# EAGLE schematic Prototyping-Board (EAGLE 5.11)
DRAWN_BY: Alexios; PROJECT_NAME: CFT Mini-Computer; REVISION: Rev K; SHEET_DESCRIPTION: Bus Connectors; SIMULATION_FILENAME: N/A; URL: http://www.bedroomlan.org/cft

## Sheet 1 of 3
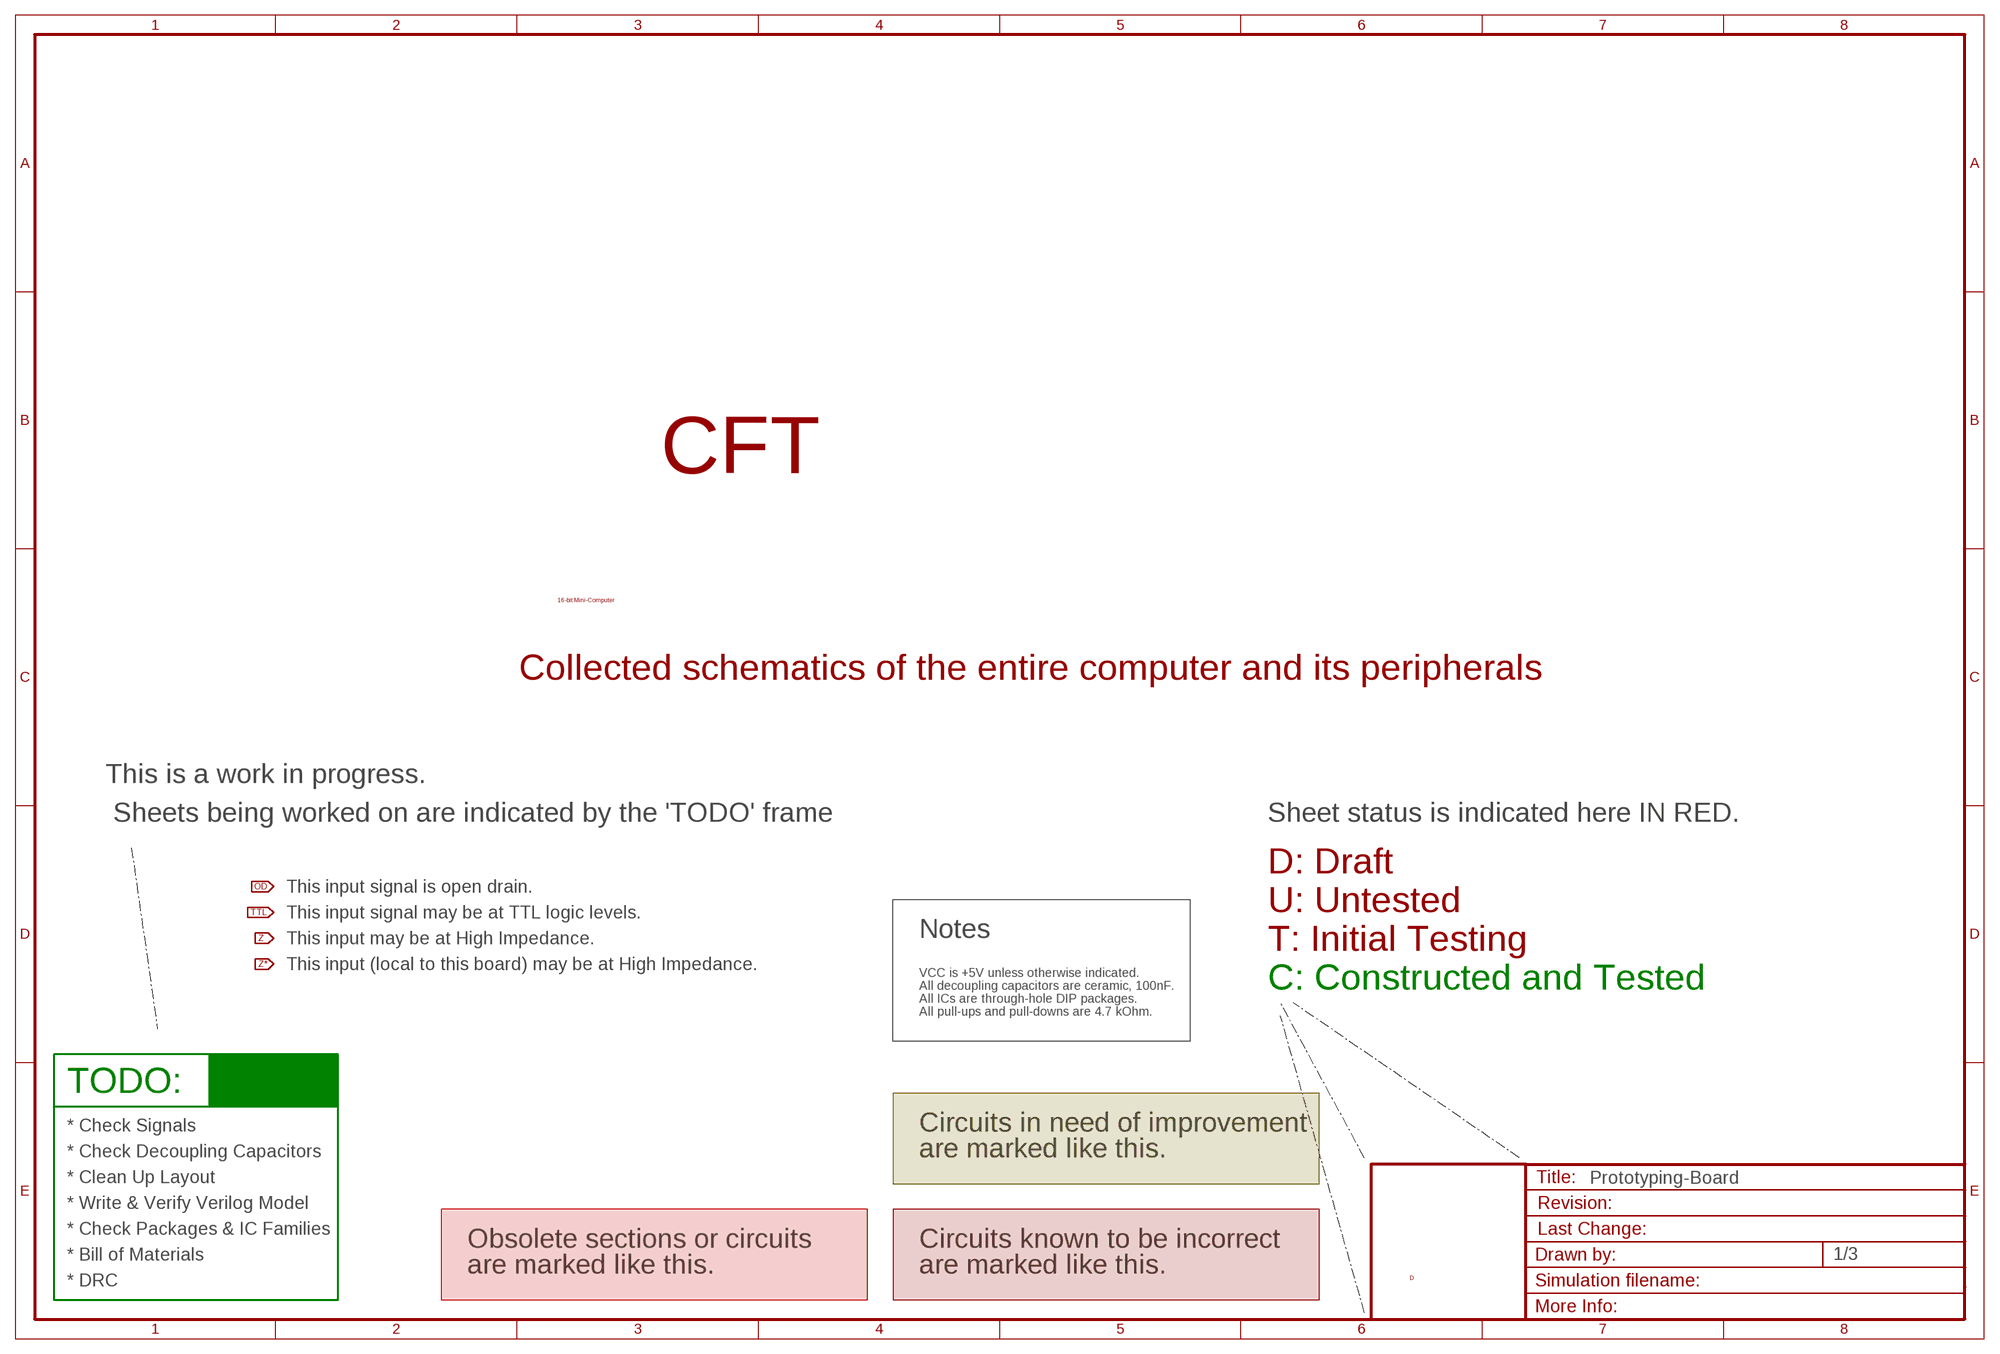
[diagram p0: schematic, sheet 1]

### Notes on the sheet
- CFT
- 16-bit Mini-Computer
- Collected schematics of the entire computer and its peripherals
- This is a work in progress.
- Sheets being worked on are indicated by the 'TODO' frame | Sheet status is indicated here IN RED.
- D: Draft
- This input signal is open drain.
- U: Untested
- This input signal may be at TTL logic levels.
- Notes
- This input may be at High Impedance.
- T: Initial Testing
- This input (local to this board) may be at High Impedance.
- VCC is +5V unless otherwise indicated.
- All decoupling capacitors are ceramic, 100nF. | C: Constructed and Tested
- All ICs are through-hole DIP packages.
- All pull-ups and pull-downs are 4.7 kOhm.
- TODO:
- * Check Signals | Circuits in need of improvement
- * Check Decoupling Capacitors | are marked like this.
- * Clean Up Layout
- * Write & Verify Verilog Model
- * Check Packages & IC Families
- Obsolete sections or circuits | Circuits known to be incorrect
- * Bill of Materials
- are marked like this. | are marked like this.
- D
- * DRC

## Sheet 2 of 3
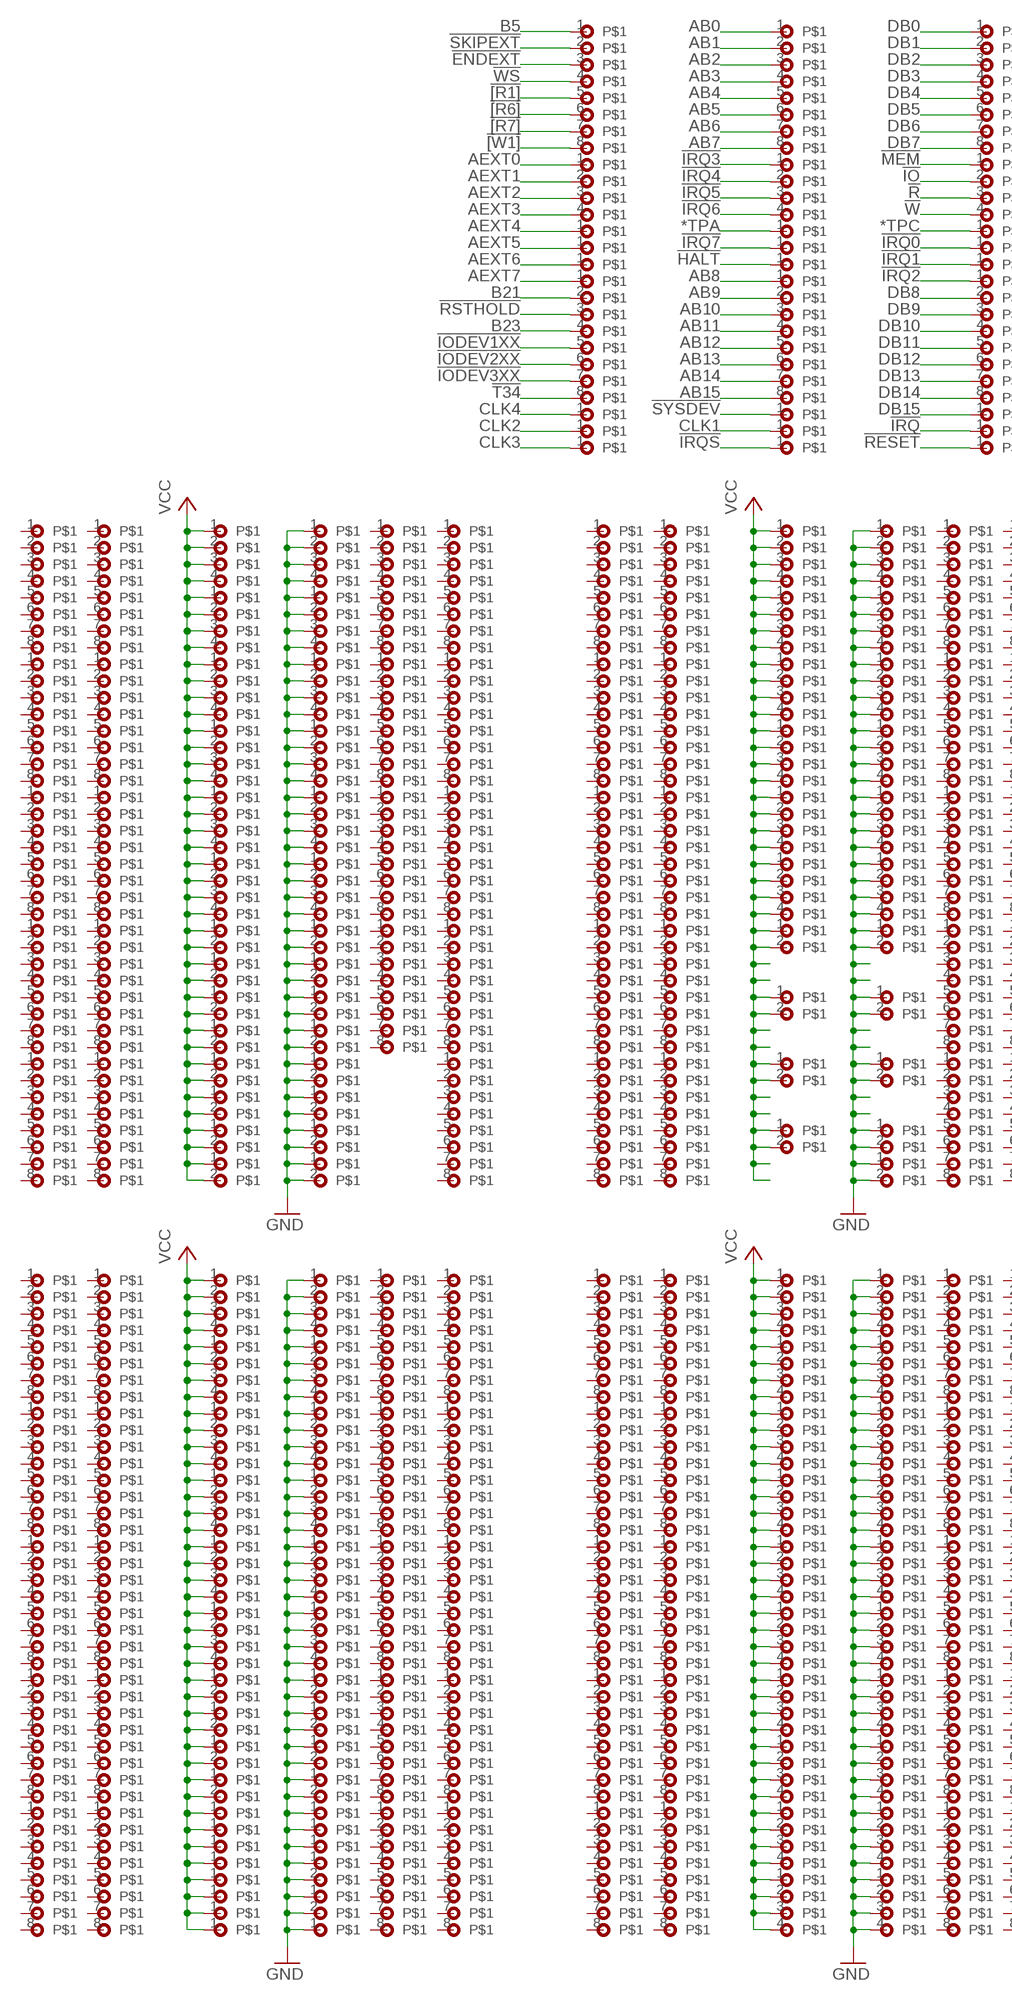
[diagram p1: schematic, sheet 2, part 1 of 3]
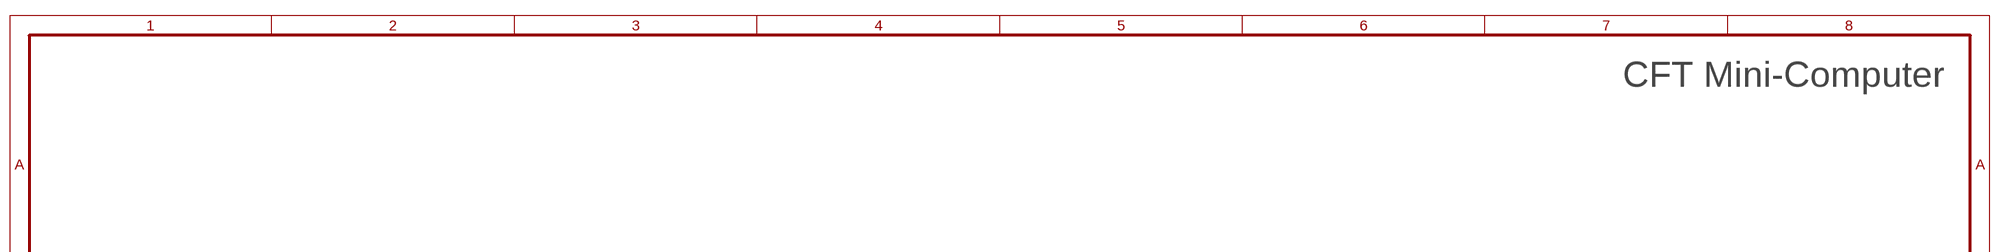
[diagram p2: schematic, sheet 2, part 2 of 3]
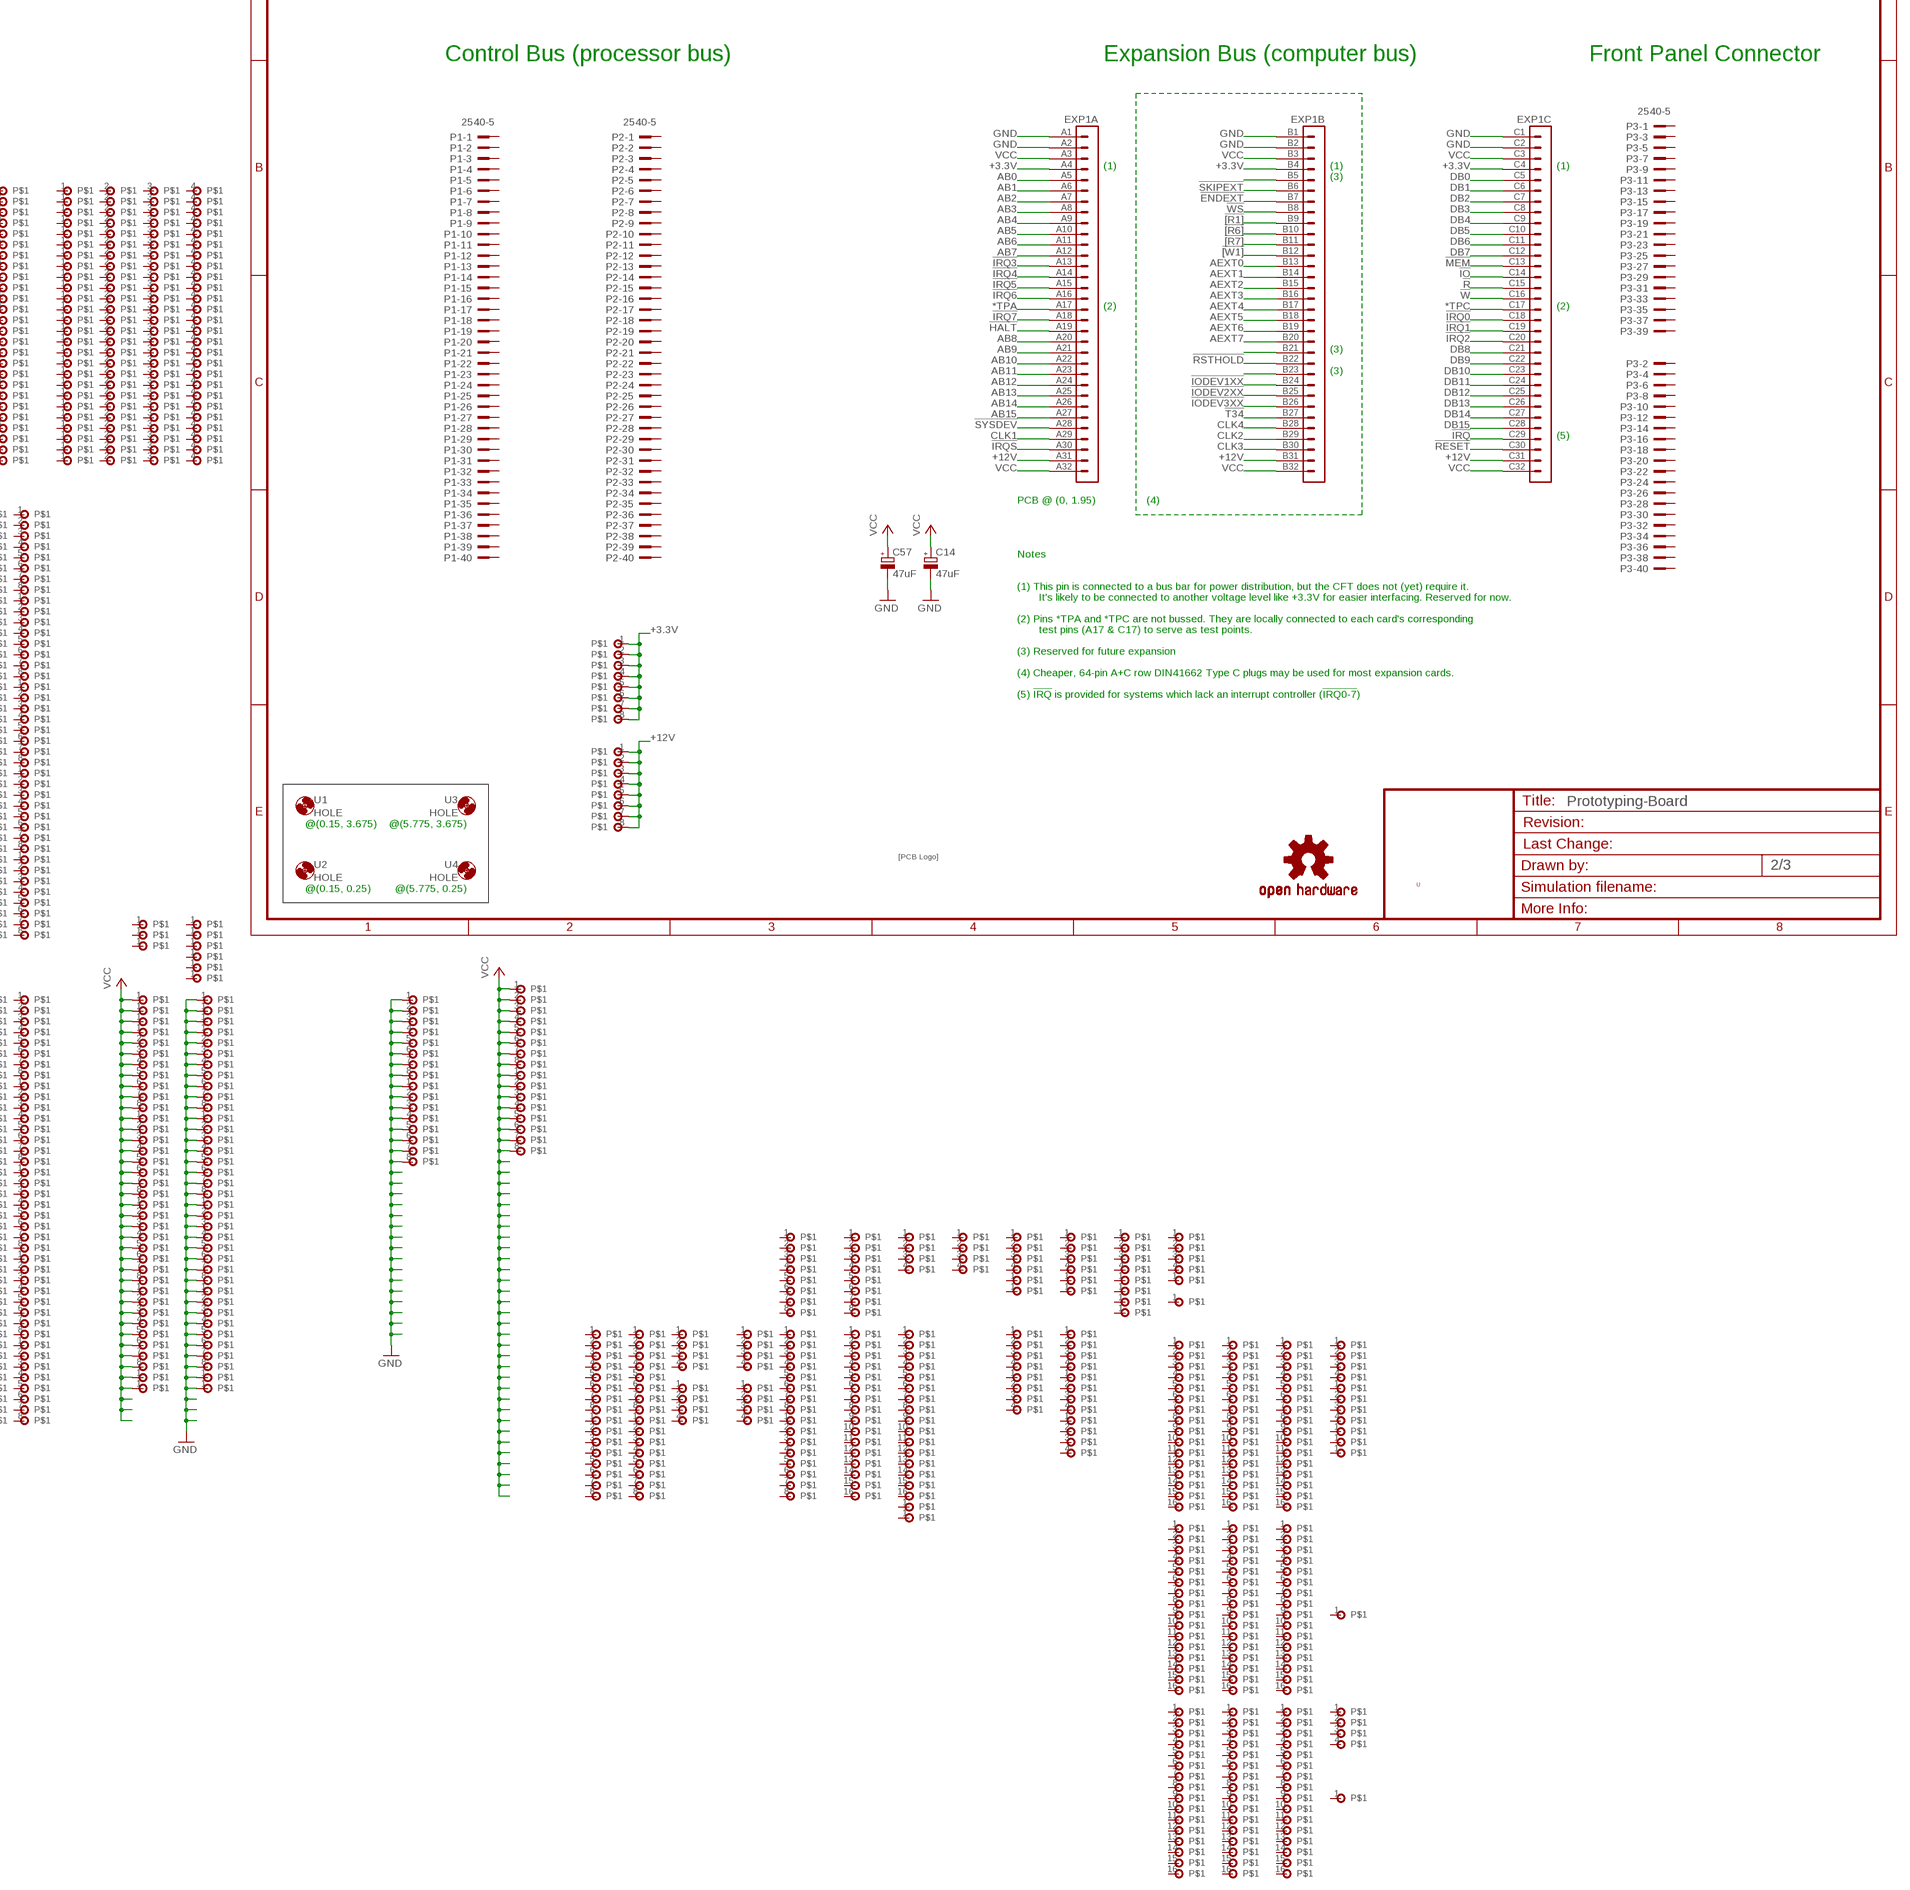
[diagram p3: schematic, sheet 2, part 3 of 3]

### Parts
$4_37_$1  SIGNATURESILK  [SIGNATURE]
$4_39_$1  OSHW-LOGOL  [OSHW-LOGO-L]
C14  47uF  CPOL-EUE2.5-5  [E2,5-5]
C57  47uF  CPOL-EUE2.5-5  [E2,5-5]
EXP1  VG96-3K  [VG96K]
P1  2540-5  [PAK100/2500-5-40]
P2  2540-5  [PAK100/2500-5-40]
P3  2540-5  [PAK100/2500-5-40]
P4  PROTOTYPING-PAD-1X8  [PAD-8X1]
P5  PROTOTYPING-PAD-1X8  [PAD-8X1]
P6  PROTOTYPING-PAD-1X4  [PAD-4X1]
P7  PROTOTYPING-PAD-1X1  [PAD-1X1]
P8  PROTOTYPING-PAD-1X1  [PAD-1X1]
P9  PROTOTYPING-PAD-1X1  [PAD-1X1]
P10  PROTOTYPING-PAD-1X1  [PAD-1X1]
P11  PROTOTYPING-PAD-1X1  [PAD-1X1]
P12  PROTOTYPING-PAD-1X1  [PAD-1X1]
P13  PROTOTYPING-PAD-1X8  [PAD-8X1]
P14  PROTOTYPING-PAD-1X8  [PAD-8X1]
P15  PROTOTYPING-PAD-1X8  [PAD-8X1]
P16  PROTOTYPING-PAD-1X8  [PAD-8X1]
P17  PROTOTYPING-PAD-1X4  [PAD-4X1]
P18  PROTOTYPING-PAD-1X1  [PAD-1X1]
P19  PROTOTYPING-PAD-1X1  [PAD-1X1]
P20  PROTOTYPING-PAD-1X1  [PAD-1X1]
P21  PROTOTYPING-PAD-1X1  [PAD-1X1]
P22  PROTOTYPING-PAD-1X1  [PAD-1X1]
P23  PROTOTYPING-PAD-1X1  [PAD-1X1]
P24  PROTOTYPING-PAD-1X8  [PAD-8X1]
P25  PROTOTYPING-PAD-1X8  [PAD-8X1]
P26  PROTOTYPING-PAD-1X4  [PAD-4X1]
P27  PROTOTYPING-PAD-1X1  [PAD-1X1]
P28  PROTOTYPING-PAD-1X1  [PAD-1X1]
P29  PROTOTYPING-PAD-1X1  [PAD-1X1]
P30  PROTOTYPING-PAD-1X1  [PAD-1X1]
P31  PROTOTYPING-PAD-1X1  [PAD-1X1]
P32  PROTOTYPING-PAD-1X1  [PAD-1X1]
P33  PROTOTYPING-PAD-1X4  [PAD-4X1]
P34  PROTOTYPING-PAD-1X4  [PAD-4X1]
P35  PROTOTYPING-PAD-1X4  [PAD-4X1]
P36  PROTOTYPING-PAD-1X4  [PAD-4X1]
P37  PROTOTYPING-PAD-1X4  [PAD-4X1]
P38  PROTOTYPING-PAD-1X4  [PAD-4X1]
P39  PROTOTYPING-PAD-1X4  [PAD-4X1]
P40  PROTOTYPING-PAD-1X4  [PAD-4X1]
P41  PROTOTYPING-PAD-1X4  [PAD-4X1]
P42  PROTOTYPING-PAD-1X4  [PAD-4X1]
P43  PROTOTYPING-PAD-1X8  [PAD-8X1]
P44  PROTOTYPING-PAD-1X8  [PAD-8X1]
P45  PROTOTYPING-PAD-1X8  [PAD-8X1]
P46  PROTOTYPING-PAD-1X8  [PAD-8X1]
P47  PROTOTYPING-PAD-1X8  [PAD-8X1]
P48  PROTOTYPING-PAD-1X8  [PAD-8X1]
P49  PROTOTYPING-PAD-1X8  [PAD-8X1]
P50  PROTOTYPING-PAD-1X8  [PAD-8X1]
P51  PROTOTYPING-PAD-1X8  [PAD-8X1]
P52  PROTOTYPING-PAD-1X8  [PAD-8X1]
P53  PROTOTYPING-PAD-1X8  [PAD-8X1]
P54  PROTOTYPING-PAD-1X8  [PAD-8X1]
P55  PROTOTYPING-PAD-1X8  [PAD-8X1]
P56  PROTOTYPING-PAD-1X8  [PAD-8X1]
P57  PROTOTYPING-PAD-1X8  [PAD-8X1]
P58  PROTOTYPING-PAD-1X8  [PAD-8X1]
P59  PROTOTYPING-PAD-1X8  [PAD-8X1]
P60  PROTOTYPING-PAD-1X8  [PAD-8X1]
P61  PROTOTYPING-PAD-1X8  [PAD-8X1]
P62  PROTOTYPING-PAD-1X8  [PAD-8X1]
P63  PROTOTYPING-PAD-1X4  [PAD-4X1]
P64  PROTOTYPING-PAD-1X4  [PAD-4X1]
P65  PROTOTYPING-PAD-1X4  [PAD-4X1]
P66  PROTOTYPING-PAD-1X4  [PAD-4X1]
P67  PROTOTYPING-PAD-1X4  [PAD-4X1]
P68  PROTOTYPING-PAD-1X4  [PAD-4X1]
P69  PROTOTYPING-PAD-1X4  [PAD-4X1]
P70  PROTOTYPING-PAD-1X4  [PAD-4X1]
P71  PROTOTYPING-PAD-1X4  [PAD-4X1]
P72  PROTOTYPING-PAD-1X4  [PAD-4X1]
P73  PROTOTYPING-PAD-1X8  [PAD-8X1]
P74  PROTOTYPING-PAD-1X8  [PAD-8X1]
P75  PROTOTYPING-PAD-1X8  [PAD-8X1]
P76  PROTOTYPING-PAD-1X8  [PAD-8X1]
P77  PROTOTYPING-PAD-1X4  [PAD-4X1]
P78  PROTOTYPING-PAD-1X8  [PAD-8X1]
P79  PROTOTYPING-PAD-1X8  [PAD-8X1]
P80  PROTOTYPING-PAD-1X8  [PAD-8X1]
P81  PROTOTYPING-PAD-1X8  [PAD-8X1]
P82  PROTOTYPING-PAD-1X8  [PAD-8X1]
P83  PROTOTYPING-PAD-1X8  [PAD-8X1]
P84  PROTOTYPING-PAD-1X8  [PAD-8X1]
P85  PROTOTYPING-PAD-1X8  [PAD-8X1]
P86  PROTOTYPING-PAD-1X8  [PAD-8X1]
P87  PROTOTYPING-PAD-1X8  [PAD-8X1]
P88  PROTOTYPING-PAD-1X8  [PAD-8X1]
P89  PROTOTYPING-PAD-1X8  [PAD-8X1]
P90  PROTOTYPING-PAD-1X8  [PAD-8X1]
P91  PROTOTYPING-PAD-1X8  [PAD-8X1]
P92  PROTOTYPING-PAD-1X8  [PAD-8X1]
P93  PROTOTYPING-PAD-1X4  [PAD-4X1]
P94  PROTOTYPING-PAD-1X4  [PAD-4X1]
P95  PROTOTYPING-PAD-1X4  [PAD-4X1]
P96  PROTOTYPING-PAD-1X4  [PAD-4X1]
P97  PROTOTYPING-PAD-1X4  [PAD-4X1]
P98  PROTOTYPING-PAD-1X4  [PAD-4X1]
P99  PROTOTYPING-PAD-1X4  [PAD-4X1]
P100  PROTOTYPING-PAD-1X4  [PAD-4X1]
P101  PROTOTYPING-PAD-1X4  [PAD-4X1]
P102  PROTOTYPING-PAD-1X4  [PAD-4X1]
P103  PROTOTYPING-PAD-1X8  [PAD-8X1]
P104  PROTOTYPING-PAD-1X8  [PAD-8X1]
P105  PROTOTYPING-PAD-1X8  [PAD-8X1]
P106  PROTOTYPING-PAD-1X8  [PAD-8X1]
P107  PROTOTYPING-PAD-1X8  [PAD-8X1]
P108  PROTOTYPING-PAD-1X8  [PAD-8X1]
P109  PROTOTYPING-PAD-1X8  [PAD-8X1]
P110  PROTOTYPING-PAD-1X8  [PAD-8X1]
P111  PROTOTYPING-PAD-1X8  [PAD-8X1]
P112  PROTOTYPING-PAD-1X8  [PAD-8X1]
P113  PROTOTYPING-PAD-1X8  [PAD-8X1]
P114  PROTOTYPING-PAD-1X8  [PAD-8X1]
P115  PROTOTYPING-PAD-1X8  [PAD-8X1]
P116  PROTOTYPING-PAD-1X8  [PAD-8X1]
P117  PROTOTYPING-PAD-1X8  [PAD-8X1]
P118  PROTOTYPING-PAD-1X8  [PAD-8X1]
P119  PROTOTYPING-PAD-1X8  [PAD-8X1]
P120  PROTOTYPING-PAD-1X8  [PAD-8X1]
P121  PROTOTYPING-PAD-1X8  [PAD-8X1]
P122  PROTOTYPING-PAD-1X8  [PAD-8X1]
P123  PROTOTYPING-PAD-1X4  [PAD-4X1]
P124  PROTOTYPING-PAD-1X4  [PAD-4X1]
P125  PROTOTYPING-PAD-1X4  [PAD-4X1]
P126  PROTOTYPING-PAD-1X4  [PAD-4X1]
P127  PROTOTYPING-PAD-1X4  [PAD-4X1]
P128  PROTOTYPING-PAD-1X4  [PAD-4X1]
P129  PROTOTYPING-PAD-1X4  [PAD-4X1]
P130  PROTOTYPING-PAD-1X4  [PAD-4X1]
P131  PROTOTYPING-PAD-1X4  [PAD-4X1]
P132  PROTOTYPING-PAD-1X4  [PAD-4X1]
P133  PROTOTYPING-PAD-1X8  [PAD-8X1]
P134  PROTOTYPING-PAD-1X8  [PAD-8X1]
P135  PROTOTYPING-PAD-1X8  [PAD-8X1]
P136  PROTOTYPING-PAD-1X8  [PAD-8X1]
P137  PROTOTYPING-PAD-1X8  [PAD-8X1]
P138  PROTOTYPING-PAD-1X8  [PAD-8X1]
P139  PROTOTYPING-PAD-1X8  [PAD-8X1]
P140  PROTOTYPING-PAD-1X8  [PAD-8X1]
P141  PROTOTYPING-PAD-1X8  [PAD-8X1]
P142  PROTOTYPING-PAD-1X8  [PAD-8X1]
P143  PROTOTYPING-PAD-1X8  [PAD-8X1]
P144  PROTOTYPING-PAD-1X8  [PAD-8X1]
P145  PROTOTYPING-PAD-1X8  [PAD-8X1]
P146  PROTOTYPING-PAD-1X8  [PAD-8X1]
P147  PROTOTYPING-PAD-1X8  [PAD-8X1]
P148  PROTOTYPING-PAD-1X8  [PAD-8X1]
P149  PROTOTYPING-PAD-1X8  [PAD-8X1]
P150  PROTOTYPING-PAD-1X8  [PAD-8X1]
P151  PROTOTYPING-PAD-1X8  [PAD-8X1]
P152  PROTOTYPING-PAD-1X8  [PAD-8X1]
P153  PROTOTYPING-PAD-1X4  [PAD-4X1]
P154  PROTOTYPING-PAD-1X4  [PAD-4X1]
P155  PROTOTYPING-PAD-1X4  [PAD-4X1]
P156  PROTOTYPING-PAD-1X4  [PAD-4X1]
P157  PROTOTYPING-PAD-1X4  [PAD-4X1]
P158  PROTOTYPING-PAD-1X4  [PAD-4X1]
P159  PROTOTYPING-PAD-1X4  [PAD-4X1]
P160  PROTOTYPING-PAD-1X4  [PAD-4X1]
P161  PROTOTYPING-PAD-1X4  [PAD-4X1]
P162  PROTOTYPING-PAD-1X4  [PAD-4X1]
P163  PROTOTYPING-PAD-1X4  [PAD-4X1]
P164  PROTOTYPING-PAD-1X4  [PAD-4X1]
P165  PROTOTYPING-PAD-1X4  [PAD-4X1]
P166  PROTOTYPING-PAD-1X4  [PAD-4X1]
P167  PROTOTYPING-PAD-1X4  [PAD-4X1]
P168  PROTOTYPING-PAD-1X4  [PAD-4X1]
P169  PROTOTYPING-PAD-1X4  [PAD-4X1]
P170  PROTOTYPING-PAD-1X4  [PAD-4X1]
P171  PROTOTYPING-PAD-1X4  [PAD-4X1]
P172  PROTOTYPING-PAD-1X4  [PAD-4X1]
P173  PROTOTYPING-PAD-1X4  [PAD-4X1]
P174  PROTOTYPING-PAD-1X4  [PAD-4X1]
P175  PROTOTYPING-PAD-1X4  [PAD-4X1]
P176  PROTOTYPING-PAD-1X4  [PAD-4X1]
P177  PROTOTYPING-PAD-1X4  [PAD-4X1]
P178  PROTOTYPING-PAD-1X4  [PAD-4X1]
P179  PROTOTYPING-PAD-1X4  [PAD-4X1]
P180  PROTOTYPING-PAD-1X4  [PAD-4X1]
P181  PROTOTYPING-PAD-1X4  [PAD-4X1]
P182  PROTOTYPING-PAD-1X4  [PAD-4X1]
P183  PROTOTYPING-PAD-1X4  [PAD-4X1]
P184  PROTOTYPING-PAD-1X4  [PAD-4X1]
P185  PROTOTYPING-PAD-1X4  [PAD-4X1]
P186  PROTOTYPING-PAD-1X4  [PAD-4X1]
P187  PROTOTYPING-PAD-1X4  [PAD-4X1]
P188  PROTOTYPING-PAD-1X4  [PAD-4X1]
P189  PROTOTYPING-PAD-1X4  [PAD-4X1]
P190  PROTOTYPING-PAD-1X4  [PAD-4X1]
P191  PROTOTYPING-PAD-1X4  [PAD-4X1]
P192  PROTOTYPING-PAD-1X4  [PAD-4X1]
P193  PROTOTYPING-PAD-1X4  [PAD-4X1]
P194  PROTOTYPING-PAD-1X1  [PAD-1X1]
P195  PROTOTYPING-PAD-1X1  [PAD-1X1]
P197  PROTOTYPING-PAD-1X8  [PAD-8X1]
P198  PROTOTYPING-PAD-1X8  [PAD-8X1]
P199  PROTOTYPING-PAD-1X8  [PAD-8X1]
P200  PROTOTYPING-PAD-1X8  [PAD-8X1]
P201  PROTOTYPING-PAD-1X4  [PAD-4X1]
P202  PROTOTYPING-PAD-1X4  [PAD-4X1]
P203  PROTOTYPING-PAD-1X4  [PAD-4X1]
P204  PROTOTYPING-PAD-1X4  [PAD-4X1]
P205  PROTOTYPING-PAD-1X8  [PAD-8X1]
P206  PROTOTYPING-PAD-1X8  [PAD-8X1]
P207  PROTOTYPING-PAD-2X8  [PAD-8X2]
P208  PROTOTYPING-PAD-2X8  [PAD-8X2]
P209  PROTOTYPING-PAD-1X1  [PAD-1X1]
P210  PROTOTYPING-PAD-1X1  [PAD-1X1]
P211  PROTOTYPING-PAD-1X8  [PAD-8X1]
P212  PROTOTYPING-PAD-1X8  [PAD-8X1]
P213  PROTOTYPING-PAD-1X4  [PAD-4X1]
P214  PROTOTYPING-PAD-1X4  [PAD-4X1]
P215  PROTOTYPING-PAD-1X4  [PAD-4X1]
P216  PROTOTYPING-PAD-1X4  [PAD-4X1]
P217  PROTOTYPING-PAD-1X1  [PAD-1X1]
P218  PROTOTYPING-PAD-1X1  [PAD-1X1]
P219  PROTOTYPING-PAD-1X1  [PAD-1X1]
P220  PROTOTYPING-PAD-1X1  [PAD-1X1]
P221  PROTOTYPING-PAD-1X4  [PAD-4X1]
P222  PROTOTYPING-PAD-1X4  [PAD-4X1]
P223  PROTOTYPING-PAD-1X1  [PAD-1X1]
P224  PROTOTYPING-PAD-1X1  [PAD-1X1]
P225  PROTOTYPING-PAD-1X1  [PAD-1X1]
P226  PROTOTYPING-PAD-1X1  [PAD-1X1]
P227  PROTOTYPING-PAD-1X1  [PAD-1X1]
P228  PROTOTYPING-PAD-1X1  [PAD-1X1]
P229  PROTOTYPING-PAD-1X4  [PAD-4X1]
P230  PROTOTYPING-PAD-1X4  [PAD-4X1]
P231  PROTOTYPING-PAD-1X4  [PAD-4X1]
P232  PROTOTYPING-PAD-1X4  [PAD-4X1]
P233  PROTOTYPING-PAD-1X4  [PAD-4X1]
P234  PROTOTYPING-PAD-2X8  [PAD-8X2]
P235  PROTOTYPING-PAD-2X8  [PAD-8X2]
P236  PROTOTYPING-PAD-2X8  [PAD-8X2]
P237  PROTOTYPING-PAD-1X4  [PAD-4X1]
P238  PROTOTYPING-PAD-1X4  [PAD-4X1]
P239  PROTOTYPING-PAD-1X1  [PAD-1X1]
P240  PROTOTYPING-PAD-1X1  [PAD-1X1]
P241  PROTOTYPING-PAD-1X1  [PAD-1X1]
P242  PROTOTYPING-PAD-2X8  [PAD-8X2]
P243  PROTOTYPING-PAD-2X8  [PAD-8X2]
P244  PROTOTYPING-PAD-2X8  [PAD-8X2]
P245  PROTOTYPING-PAD-1X1  [PAD-1X1]
P246  PROTOTYPING-PAD-1X1  [PAD-1X1]
P247  PROTOTYPING-PAD-1X1  [PAD-1X1]
P248  PROTOTYPING-PAD-1X1  [PAD-1X1]
P249  PROTOTYPING-PAD-1X1  [PAD-1X1]
P250  PROTOTYPING-PAD-2X8  [PAD-8X2]
P251  PROTOTYPING-PAD-2X8  [PAD-8X2]
P252  PROTOTYPING-PAD-2X8  [PAD-8X2]
P253  PROTOTYPING-PAD-1X4  [PAD-4X1]
P254  PROTOTYPING-PAD-1X1  [PAD-1X1]
P255  PROTOTYPING-PAD-1X1  [PAD-1X1]
P256  PROTOTYPING-PAD-1X1  [PAD-1X1]
P257  PROTOTYPING-PAD-1X1  [PAD-1X1]
P258  PROTOTYPING-PAD-1X1  [PAD-1X1]
P259  PROTOTYPING-PAD-1X1  [PAD-1X1]
P260  PROTOTYPING-PAD-1X1  [PAD-1X1]
P261  PROTOTYPING-PAD-1X1  [PAD-1X1]
P262  PROTOTYPING-PAD-1X1  [PAD-1X1]
P263  PROTOTYPING-PAD-1X1  [PAD-1X1]
P264  PROTOTYPING-PAD-1X8  [PAD-8X1]
P265  PROTOTYPING-PAD-1X1  [PAD-1X1]
P266  PROTOTYPING-PAD-1X1  [PAD-1X1]
P267  PROTOTYPING-PAD-1X1  [PAD-1X1]
P268  PROTOTYPING-PAD-1X8  [PAD-8X1]
P269  PROTOTYPING-PAD-1X8  [PAD-8X1]
P270  PROTOTYPING-PAD-1X8  [PAD-8X1]
P271  PROTOTYPING-PAD-1X8  [PAD-8X1]
P272  PROTOTYPING-PAD-1X1  [PAD-1X1]
P273  PROTOTYPING-PAD-1X1  [PAD-1X1]
P274  PROTOTYPING-PAD-1X1  [PAD-1X1]
P275  PROTOTYPING-PAD-1X8  [PAD-8X1]
P276  PROTOTYPING-PAD-1X8  [PAD-8X1]
P277  PROTOTYPING-PAD-1X8  [PAD-8X1]
P278  PROTOTYPING-PAD-1X8  [PAD-8X1]
P279  PROTOTYPING-PAD-1X8  [PAD-8X1]
P280  PROTOTYPING-PAD-1X8  [PAD-8X1]
P281  PROTOTYPING-PAD-1X8  [PAD-8X1]
P282  PROTOTYPING-PAD-1X1  [PAD-1X1]
P283  PROTOTYPING-PAD-1X1  [PAD-1X1]
P284  PROTOTYPING-PAD-1X1  [PAD-1X1]
P285  PROTOTYPING-PAD-1X1  [PAD-1X1]
P286  PROTOTYPING-PAD-1X1  [PAD-1X1]
P287  PROTOTYPING-PAD-1X1  [PAD-1X1]
P288  PROTOTYPING-PAD-1X1  [PAD-1X1]
P289  PROTOTYPING-PAD-1X1  [PAD-1X1]
P290  PROTOTYPING-PAD-1X1  [PAD-1X1]
P291  PROTOTYPING-PAD-1X1  [PAD-1X1]
U1  HOLE  [STANDOFF_28_60]
U2  HOLE  [STANDOFF_28_60]
U3  HOLE  [STANDOFF_28_60]
U4  HOLE  [STANDOFF_28_60]
U$1  PROTOTYPING-PAD-1X2  [PAD-1X2]
U$2  PROTOTYPING-PAD-1X2  [PAD-1X2]
U$3  PROTOTYPING-PAD-1X2  [PAD-1X2]
U$4  PROTOTYPING-PAD-1X2  [PAD-1X2]
U$5  PROTOTYPING-PAD-1X2  [PAD-1X2]
U$6  PROTOTYPING-PAD-1X2  [PAD-1X2]
U$11  PROTOTYPING-PAD-1X2  [PAD-1X2]
U$12  PROTOTYPING-PAD-1X2  [PAD-1X2]
U$13  PROTOTYPING-PAD-1X2  [PAD-1X2]
U$14  PROTOTYPING-PAD-1X2  [PAD-1X2]
U$15  PROTOTYPING-PAD-1X2  [PAD-1X2]
U$16  PROTOTYPING-PAD-1X2  [PAD-1X2]
U$17  PROTOTYPING-PAD-1X2  [PAD-1X2]
U$18  PROTOTYPING-PAD-1X2  [PAD-1X2]
U$19  PROTOTYPING-PAD-1X2  [PAD-1X2]
U$20  PROTOTYPING-PAD-1X2  [PAD-1X2]
U$21  PROTOTYPING-PAD-1X2  [PAD-1X2]
U$23  PROTOTYPING-PAD-1X2  [PAD-1X2]
U$25  PROTOTYPING-PAD-1X2  [PAD-1X2]
U$27  PROTOTYPING-PAD-1X2  [PAD-1X2]
U$29  PROTOTYPING-PAD-1X2  [PAD-1X2]
U$31  PROTOTYPING-PAD-1X2  [PAD-1X2]
U$33  PROTOTYPING-PAD-1X2  [PAD-1X2]
U$35  PROTOTYPING-PAD-1X2  [PAD-1X2]
U$36  PROTOTYPING-PAD-1X2  [PAD-1X2]
U$37  PROTOTYPING-PAD-1X2  [PAD-1X2]
U$38  PROTOTYPING-PAD-1X2  [PAD-1X2]
U$39  PROTOTYPING-PAD-1X2  [PAD-1X2]
U$40  PROTOTYPING-PAD-1X2  [PAD-1X2]
U$41  PROTOTYPING-PAD-1X2  [PAD-1X2]
U$42  PROTOTYPING-PAD-1X2  [PAD-1X2]
U$43  PROTOTYPING-PAD-1X2  [PAD-1X2]
U$44  PROTOTYPING-PAD-1X2  [PAD-1X2]
U$45  PROTOTYPING-PAD-1X2  [PAD-1X2]
U$46  PROTOTYPING-PAD-1X2  [PAD-1X2]

### Nets
![R1]: EXP1.B9 P15.5
![R6]: EXP1.B10 P15.6
![R7]: EXP1.B11 P15.7
![W1]: EXP1.B12 P15.8
!ENDEXT: EXP1.B7 P15.3
!HALT: EXP1.A19 P9.1
!IO: EXP1.C14 P26.2
!IODEV1XX: EXP1.B24 P16.5
!IODEV2XX: EXP1.B25 P16.6
!IODEV3XX: EXP1.B26 P16.7
!IRQ: EXP1.C29 P31.1
!IRQ0: EXP1.C18 P28.1
!IRQ1: EXP1.C19 P29.1
!IRQ2: EXP1.C20 P25.1
!IRQ3: EXP1.A13 P6.1
!IRQ4: EXP1.A14 P6.2
!IRQ5: EXP1.A15 P6.3
!IRQ6: EXP1.A16 P6.4
!IRQ7: EXP1.A18 P8.1
!IRQS: EXP1.A30 P12.1
!MEM: EXP1.C13 P26.1
!R: EXP1.C15 P26.3
!RESET: EXP1.C30 P32.1
!RSTHOLD: EXP1.B22 P16.3
!SKIPEXT: EXP1.B6 P15.2
!SYSDEV: EXP1.A28 P10.1
!T34: EXP1.B27 P16.8
!W: EXP1.C16 P26.4
!WS: EXP1.B8 P15.4
*TPA: EXP1.A17 P7.1
*TPC: EXP1.C17 P27.1
+3.3V: EXP1.A4 EXP1.B4 EXP1.C4 P14.1 P14.2 P14.3 P14.4 P14.5 P14.6 P14.7 P14.8
+12V [Power rails]: EXP1.A31 EXP1.B31 EXP1.C31 P13.1 P13.2 P13.3 P13.4 P13.5 P13.6 P13.7 P13.8
AB0: EXP1.A5 P4.1
AB1: EXP1.A6 P4.2
AB2: EXP1.A7 P4.3
AB3: EXP1.A8 P4.4
AB4: EXP1.A9 P4.5
AB5: EXP1.A10 P4.6
AB6: EXP1.A11 P4.7
AB7: EXP1.A12 P4.8
AB8: EXP1.A20 P5.1
AB9: EXP1.A21 P5.2
AB10: EXP1.A22 P5.3
AB11: EXP1.A23 P5.4
AB12: EXP1.A24 P5.5
AB13: EXP1.A25 P5.6
AB14: EXP1.A26 P5.7
AB15: EXP1.A27 P5.8
AEXT0: EXP1.B13 P17.1
AEXT1: EXP1.B14 P17.2
AEXT2: EXP1.B15 P17.3
AEXT3: EXP1.B16 P17.4
AEXT4: EXP1.B17 P18.1
AEXT5: EXP1.B18 P19.1
AEXT6: EXP1.B19 P20.1
AEXT7: EXP1.B20 P16.1
B5: EXP1.B5 P15.1
B21: EXP1.B21 P16.2
B23: EXP1.B23 P16.4
CLK1: EXP1.A29 P11.1
CLK2: EXP1.B29 P22.1
CLK3: EXP1.B30 P23.1
CLK4: EXP1.B28 P21.1
DB0: EXP1.C5 P24.1
DB1: EXP1.C6 P24.2
DB2: EXP1.C7 P24.3
DB3: EXP1.C8 P24.4
DB4: EXP1.C9 P24.5
DB5: EXP1.C10 P24.6
DB6: EXP1.C11 P24.7
DB7: EXP1.C12 P24.8
DB8: EXP1.C21 P25.2
DB9: EXP1.C22 P25.3
DB10: EXP1.C23 P25.4
DB11: EXP1.C24 P25.5
DB12: EXP1.C25 P25.6
DB13: EXP1.C26 P25.7
DB14: EXP1.C27 P25.8
DB15: EXP1.C28 P30.1
GND [Power rails]: C14.- C57.- EXP1.A1 EXP1.A2 EXP1.B1 EXP1.B2 EXP1.C1 EXP1.C2 P71.1 P71.2 P71.3 P71.4 P72.1 P72.2 P72.3 P72.4 P77.1 P77.2 P77.3 P77.4 P93.1 P93.2 P93.3 P93.4 P94.1 P94.2 P94.3 P94.4 P95.1 P95.2 P95.3 P95.4 P96.1 P96.2 P96.3 P96.4 P97.1 P97.2 P97.3 P97.4 P98.1 P98.2 P98.3 P98.4 P99.1 P99.2 P99.3 P99.4 P100.1 P100.2 P100.3 P100.4 P101.1 P101.2 P101.3 P101.4 P102.1 P102.2 P102.3 P102.4 P123.1 P123.2 P123.3 P123.4 P124.1 P124.2 P124.3 P124.4 P125.1 P125.2 P125.3 P125.4 P126.1 P126.2 P126.3 P126.4 P127.1 P127.2 P127.3 P127.4 P153.1 P153.2 P153.3 P153.4 P154.1 P154.2 P154.3 P154.4 P155.1 P155.2 P155.3 P155.4 P156.1 P156.2 P156.3 P156.4 P157.1 P157.2 P157.3 P157.4 P189.1 P189.2 P189.3 P189.4 P190.1 P190.2 P190.3 P190.4 P191.1 P191.2 P191.3 P191.4 P192.1 P192.2 P192.3 P192.4 P193.1 P193.2 P193.3 P193.4 P246.1 P248.1 P249.1 P254.1 P264.1 P264.2 P264.3 P264.4 P264.5 P264.6 P264.7 P264.8 P265.1 P266.1 P267.1 P268.1 P268.2 P268.3 P268.4 P268.5 P268.6 P268.7 P268.8 P269.1 P269.2 P269.3 P269.4 P269.5 P269.6 P269.7 P269.8 P270.1 P270.2 P270.3 P270.4 P270.5 P270.6 P270.7 P270.8 P271.1 P271.2 P271.3 P271.4 P271.5 P271.6 P271.7 P271.8 P275.1 P275.2 P275.3 P275.4 P275.5 P275.6 P275.7 P275.8 P283.1 P285.1 U$13.1 U$13.2 U$14.1 U$14.2 U$15.1 U$15.2 U$16.1 U$16.2 U$17.1 U$17.2 U$18.1 U$18.2 U$19.1 U$19.2 U$20.1 U$20.2 U$29.1 U$29.2 U$31.1 U$31.2 U$33.1 U$33.2 U$35.1 U$35.2 U$36.1 U$36.2 U$39.1 U$39.2 U$40.1 U$40.2 U$42.1 U$42.2 U$44.1 U$44.2 U$45.1 U$45.2 U$46.1 U$46.2 ; also sheet 3
VCC [Power rails]: C14.+ C57.+ EXP1.A3 EXP1.A32 EXP1.B3 EXP1.B32 EXP1.C3 EXP1.C32 P33.1 P33.2 P33.3 P33.4 P34.1 P34.2 P34.3 P34.4 P35.1 P35.2 P35.3 P35.4 P36.1 P36.2 P36.3 P36.4 P37.1 P37.2 P37.3 P37.4 P38.1 P38.2 P38.3 P38.4 P39.1 P39.2 P39.3 P39.4 P40.1 P40.2 P40.3 P40.4 P41.1 P41.2 P41.3 P41.4 P42.1 P42.2 P42.3 P42.4 P63.1 P63.2 P63.3 P63.4 P64.1 P64.2 P64.3 P64.4 P65.1 P65.2 P65.3 P65.4 P66.1 P66.2 P66.3 P66.4 P67.1 P67.2 P67.3 P67.4 P68.1 P68.2 P68.3 P68.4 P69.1 P69.2 P69.3 P69.4 P70.1 P70.2 P70.3 P70.4 P128.1 P128.2 P128.3 P128.4 P129.1 P129.2 P129.3 P129.4 P130.1 P130.2 P130.3 P130.4 P131.1 P131.2 P131.3 P131.4 P132.1 P132.2 P132.3 P132.4 P158.1 P158.2 P158.3 P158.4 P159.1 P159.2 P159.3 P159.4 P186.1 P186.2 P186.3 P186.4 P187.1 P187.2 P187.3 P187.4 P188.1 P188.2 P188.3 P188.4 P194.1 P195.1 P245.1 P256.1 P257.1 P258.1 P259.1 P260.1 P261.1 P262.1 P263.1 P276.1 P276.2 P276.3 P276.4 P276.5 P276.6 P276.7 P276.8 P277.1 P277.2 P277.3 P277.4 P277.5 P277.6 P277.7 P277.8 P278.1 P278.2 P278.3 P278.4 P278.5 P278.6 P278.7 P278.8 P279.1 P279.2 P279.3 P279.4 P279.5 P279.6 P279.7 P279.8 P280.1 P280.2 P280.3 P280.4 P280.5 P280.6 P280.7 P280.8 P281.1 P281.2 P281.3 P281.4 P281.5 P281.6 P281.7 P281.8 P282.1 P284.1 U$1.1 U$1.2 U$2.1 U$2.2 U$3.1 U$3.2 U$4.1 U$4.2 U$5.1 U$5.2 U$6.1 U$6.2 U$11.1 U$11.2 U$12.1 U$12.2 U$21.1 U$21.2 U$23.1 U$23.2 U$25.1 U$25.2 U$27.1 U$27.2 U$37.1 U$37.2 U$38.1 U$38.2 U$41.1 U$41.2 U$43.1 U$43.2 ; also sheet 3
Unconnected: P1.1 P1.2 P1.3 P1.4 P1.5 P1.6 P1.7 P1.8 P1.9 P1.10 P1.11 P1.12 P1.13 P1.14 P1.15 P1.16 P1.17 P1.18 P1.19 P1.20 P1.21 P1.22 P1.23 P1.24 P1.25 P1.26 P1.27 P1.28 P1.29 P1.30 P1.31 P1.32 P1.33 P1.34 P1.35 P1.36 P1.37 P1.38 P1.39 P1.40 P2.1 P2.2 P2.3 P2.4 P2.5 P2.6 P2.7 P2.8 P2.9 P2.10 P2.11 P2.12 P2.13 P2.14 P2.15 P2.16 P2.17 P2.18 P2.19 P2.20 P2.21 P2.22 P2.23 P2.24 P2.25 P2.26 P2.27 P2.28 P2.29 P2.30 P2.31 P2.32 P2.33 P2.34 P2.35 P2.36 P2.37 P2.38 P2.39 P2.40 P3.1 P3.2 P3.3 P3.4 P3.5 P3.6 P3.7 P3.8 P3.9 P3.10 P3.11 P3.12 P3.13 P3.14 P3.15 P3.16 P3.17 P3.18 P3.19 P3.20 P3.21 P3.22 P3.23 P3.24 P3.25 P3.26 P3.27 P3.28 P3.29 P3.30 P3.31 P3.32 P3.33 P3.34 P3.35 P3.36 P3.37 P3.38 P3.39 P3.40 P43.1 P43.2 P43.3 P43.4 P43.5 P43.6 P43.7 P43.8 P44.1 P44.2 P44.3 P44.4 P44.5 P44.6 P44.7 P44.8 P45.1 P45.2 P45.3 P45.4 P45.5 P45.6 P45.7 P45.8 P46.1 P46.2 P46.3 P46.4 P46.5 P46.6 P46.7 P46.8 P47.1 P47.2 P47.3 P47.4 P47.5 P47.6 P47.7 P47.8 P48.1 P48.2 P48.3 P48.4 P48.5 P48.6 P48.7 P48.8 P49.1 P49.2 P49.3 P49.4 P49.5 P49.6 P49.7 P49.8 P50.1 P50.2 P50.3 P50.4 P50.5 P50.6 P50.7 P50.8 P51.1 P51.2 P51.3 P51.4 P51.5 P51.6 P51.7 P51.8 P52.1 P52.2 P52.3 P52.4 P52.5 P52.6 P52.7 P52.8 P53.1 P53.2 P53.3 P53.4 P53.5 P53.6 P53.7 P53.8 P54.1 P54.2 P54.3 P54.4 P54.5 P54.6 P54.7 P54.8 P55.1 P55.2 P55.3 P55.4 P55.5 P55.6 P55.7 P55.8 P56.1 P56.2 P56.3 P56.4 P56.5 P56.6 P56.7 P56.8 P57.1 P57.2 P57.3 P57.4 P57.5 P57.6 P57.7 P57.8 P58.1 P58.2 P58.3 P58.4 P58.5 P58.6 P58.7 P58.8 P59.1 P59.2 P59.3 P59.4 P59.5 P59.6 P59.7 P59.8 P60.1 P60.2 P60.3 P60.4 P60.5 P60.6 P60.7 P60.8 P61.1 P61.2 P61.3 P61.4 P61.5 P61.6 P61.7 P61.8 P62.1 P62.2 P62.3 P62.4 P62.5 P62.6 P62.7 P62.8 P73.1 P73.2 P73.3 P73.4 P73.5 P73.6 P73.7 P73.8 P74.1 P74.2 P74.3 P74.4 P74.5 P74.6 P74.7 P74.8 P75.1 P75.2 P75.3 P75.4 P75.5 P75.6 P75.7 P75.8 P76.1 P76.2 P76.3 P76.4 P76.5 P76.6 P76.7 P76.8 P78.1 P78.2 P78.3 P78.4 P78.5 P78.6 P78.7 P78.8 P79.1 P79.2 P79.3 P79.4 P79.5 P79.6 P79.7 P79.8 P80.1 P80.2 P80.3 P80.4 P80.5 P80.6 P80.7 P80.8 P81.1 P81.2 P81.3 P81.4 P81.5 P81.6 P81.7 P81.8 P82.1 P82.2 P82.3 P82.4 P82.5 P82.6 P82.7 P82.8 P83.1 P83.2 P83.3 P83.4 P83.5 P83.6 P83.7 P83.8 P84.1 P84.2 P84.3 P84.4 P84.5 P84.6 P84.7 P84.8 P85.1 P85.2 P85.3 P85.4 P85.5 P85.6 P85.7 P85.8 P86.1 P86.2 P86.3 P86.4 P86.5 P86.6 P86.7 P86.8 P87.1 P87.2 P87.3 P87.4 P87.5 P87.6 P87.7 P87.8 P88.1 P88.2 P88.3 P88.4 P88.5 P88.6 P88.7 P88.8 P89.1 P89.2 P89.3 P89.4 P89.5 P89.6 P89.7 P89.8 P90.1 P90.2 P90.3 P90.4 P90.5 P90.6 P90.7 P90.8 P91.1 P91.2 P91.3 P91.4 P91.5 P91.6 P91.7 P91.8 P92.1 P92.2 P92.3 P92.4 P92.5 P92.6 P92.7 P92.8 P103.1 P103.2 P103.3 P103.4 P103.5 P103.6 P103.7 P103.8 P104.1 P104.2 P104.3 P104.4 P104.5 P104.6 P104.7 P104.8 P105.1 P105.2 P105.3 P105.4 P105.5 P105.6 P105.7 P105.8 P106.1 P106.2 P106.3 P106.4 P106.5 P106.6 P106.7 P106.8 P107.1 P107.2 P107.3 P107.4 P107.5 P107.6 P107.7 P107.8 P108.1 P108.2 P108.3 P108.4 P108.5 P108.6 P108.7 P108.8 P109.1 P109.2 P109.3 P109.4 P109.5 P109.6 P109.7 P109.8 P110.1 P110.2 P110.3 P110.4 P110.5 P110.6 P110.7 P110.8 P111.1 P111.2 P111.3 P111.4 P111.5 P111.6 P111.7 P111.8 P112.1 P112.2 P112.3 P112.4 P112.5 P112.6 P112.7 P112.8 P113.1 P113.2 P113.3 P113.4 P113.5 P113.6 P113.7 P113.8 P114.1 P114.2 P114.3 P114.4 P114.5 P114.6 P114.7 P114.8 P115.1 P115.2 P115.3 P115.4 P115.5 P115.6 P115.7 P115.8 P116.1 P116.2 P116.3 P116.4 P116.5 P116.6 P116.7 P116.8 P117.1 P117.2 P117.3 P117.4 P117.5 P117.6 P117.7 P117.8 P118.1 P118.2 P118.3 P118.4 P118.5 P118.6 P118.7 P118.8 P119.1 P119.2 P119.3 P119.4 P119.5 P119.6 P119.7 P119.8 P120.1 P120.2 P120.3 P120.4 P120.5 P120.6 P120.7 P120.8 P121.1 P121.2 P121.3 P121.4 P121.5 P121.6 P121.7 P121.8 P122.1 P122.2 P122.3 P122.4 P122.5 P122.6 P122.7 P122.8 P133.1 P133.2 P133.3 P133.4 P133.5 P133.6 P133.7 P133.8 P134.1 P134.2 P134.3 P134.4 P134.5 P134.6 P134.7 P134.8 P135.1 P135.2 P135.3 P135.4 P135.5 P135.6 P135.7 P135.8 P136.1 P136.2 P136.3 P136.4 P136.5 P136.6 P136.7 P136.8 P137.1 P137.2 P137.3 P137.4 P137.5 P137.6 P137.7 P137.8 P138.1 P138.2 P138.3 P138.4 P138.5 P138.6 P138.7 P138.8 P139.1 P139.2 P139.3 P139.4 P139.5 P139.6 P139.7 P139.8 P140.1 P140.2 P140.3 P140.4 P140.5 P140.6 P140.7 P140.8 P141.1 P141.2 P141.3 P141.4 P141.5 P141.6 P141.7 P141.8 P142.1 P142.2 P142.3 P142.4 P142.5 P142.6 P142.7 P142.8 P143.1 P143.2 P143.3 P143.4 P143.5 P143.6 P143.7 P143.8 P144.1 P144.2 P144.3 P144.4 P144.5 P144.6 P144.7 P144.8 P145.1 P145.2 P145.3 P145.4 P145.5 P145.6 P145.7 P145.8 P146.1 P146.2 P146.3 P146.4 P146.5 P146.6 P146.7 P146.8 P147.1 P147.2 P147.3 P147.4 P147.5 P147.6 P147.7 P147.8 P148.1 P148.2 P148.3 P148.4 P148.5 P148.6 P148.7 P148.8 P149.1 P149.2 P149.3 P149.4 P149.5 P149.6 P149.7 P149.8 P150.1 P150.2 P150.3 P150.4 P150.5 P150.6 P150.7 P150.8 P151.1 P151.2 P151.3 P151.4 P151.5 P151.6 P151.7 P151.8 P152.1 P152.2 P152.3 P152.4 P152.5 P152.6 P152.7 P152.8 P160.1 P160.2 P160.3 P160.4 P161.1 P161.2 P161.3 P161.4 P162.1 P162.2 P162.3 P162.4 P163.1 P163.2 P163.3 P163.4 P164.1 P164.2 P164.3 P164.4 P165.1 P165.2 P165.3 P165.4 P166.1 P166.2 P166.3 P166.4 P167.1 P167.2 P167.3 P167.4 P168.1 P168.2 P168.3 P168.4 P169.1 P169.2 P169.3 P169.4 P170.1 P170.2 P170.3 P170.4 P171.1 P171.2 P171.3 P171.4 P172.1 P172.2 P172.3 P172.4 P173.1 P173.2 P173.3 P173.4 P174.1 P174.2 P174.3 P174.4 P175.1 P175.2 P175.3 P175.4 P176.1 P176.2 P176.3 P176.4 P177.1 P177.2 P177.3 P177.4 P178.1 P178.2 P178.3 P178.4 P179.1 P179.2 P179.3 P179.4 P180.1 P180.2 P180.3 P180.4 P181.1 P181.2 P181.3 P181.4 P182.1 P182.2 P182.3 P182.4 P183.1 P183.2 P183.3 P183.4 P184.1 P184.2 P184.3 P184.4 P185.1 P185.2 P185.3 P185.4 P197.1 P197.2 P197.3 P197.4 P197.5 P197.6 P197.7 P197.8 P198.1 P198.2 P198.3 P198.4 P198.5 P198.6 P198.7 P198.8 P199.1 P199.2 P199.3 P199.4 P199.5 P199.6 P199.7 P199.8 P200.1 P200.2 P200.3 P200.4 P200.5 P200.6 P200.7 P200.8 P201.1 P201.2 P201.3 P201.4 P202.1 P202.2 P202.3 P202.4 P203.1 P203.2 P203.3 P203.4 P204.1 P204.2 P204.3 P204.4 P205.1 P205.2 P205.3 P205.4 P205.5 P205.6 P205.7 P205.8 P206.1 P206.2 P206.3 P206.4 P206.5 P206.6 P206.7 P206.8 P207.1 P207.2 P207.3 P207.4 P207.5 P207.6 P207.7 P207.8 P207.9 P207.10 P207.11 P207.12 P207.13 P207.14 P207.15 P207.16 P208.1 P208.2 P208.3 P208.4 P208.5 P208.6 P208.7 P208.8 P208.9 P208.10 P208.11 P208.12 P208.13 P208.14 P208.15 P208.16 P209.1 P210.1 P211.1 P211.2 P211.3 P211.4 P211.5 P211.6 P211.7 P211.8 P212.1 P212.2 P212.3 P212.4 P212.5 P212.6 P212.7 P212.8 P213.1 P213.2 P213.3 P213.4 P214.1 P214.2 P214.3 P214.4 P215.1 P215.2 P215.3 P215.4 P216.1 P216.2 P216.3 P216.4 P217.1 P218.1 P219.1 P220.1 P221.1 P221.2 P221.3 P221.4 P222.1 P222.2 P222.3 P222.4 P223.1 P224.1 P225.1 P226.1 P227.1 P228.1 P229.1 P229.2 P229.3 P229.4 P230.1 P230.2 P230.3 P230.4 P231.1 P231.2 P231.3 P231.4 P232.1 P232.2 P232.3 P232.4 P233.1 P233.2 P233.3 P233.4 P234.1 P234.2 P234.3 P234.4 P234.5 P234.6 P234.7 P234.8 P234.9 P234.10 P234.11 P234.12 P234.13 P234.14 P234.15 P234.16 P235.1 P235.2 P235.3 P235.4 P235.5 P235.6 P235.7 P235.8 P235.9 P235.10 P235.11 P235.12 P235.13 P235.14 P235.15 P235.16 P236.1 P236.2 P236.3 P236.4 P236.5 P236.6 P236.7 P236.8 P236.9 P236.10 P236.11 P236.12 P236.13 P236.14 P236.15 P236.16 P237.1 P237.2 P237.3 P237.4 P238.1 P238.2 P238.3 P238.4 P239.1 P240.1 P241.1 P242.1 P242.2 P242.3 P242.4 P242.5 P242.6 P242.7 P242.8 P242.9 P242.10 P242.11 P242.12 P242.13 P242.14 P242.15 P242.16 P243.1 P243.2 P243.3 P243.4 P243.5 P243.6 P243.7 P243.8 P243.9 P243.10 P243.11 P243.12 P243.13 P243.14 P243.15 P243.16 P244.1 P244.2 P244.3 P244.4 P244.5 P244.6 P244.7 P244.8 P244.9 P244.10 P244.11 P244.12 P244.13 P244.14 P244.15 P244.16 P247.1 P250.1 P250.2 P250.3 P250.4 P250.5 P250.6 P250.7 P250.8 P250.9 P250.10 P250.11 P250.12 P250.13 P250.14 P250.15 P250.16 P251.1 P251.2 P251.3 P251.4 P251.5 P251.6 P251.7 P251.8 P251.9 P251.10 P251.11 P251.12 P251.13 P251.14 P251.15 P251.16 P252.1 P252.2 P252.3 P252.4 P252.5 P252.6 P252.7 P252.8 P252.9 P252.10 P252.11 P252.12 P252.13 P252.14 P252.15 P252.16 P253.1 P253.2 P253.3 P253.4 P255.1 P272.1 P273.1 P274.1 P286.1 P287.1 P288.1 P289.1 P290.1 P291.1

### Notes on the sheet
- CFT Mini-Computer
- Control Bus (processor bus) | Expansion Bus (computer bus) | Front Panel Connector
- (1) | (1) | (1)
- (3)
- (2) | (2)
- (3)
- (3)
- (5)
- PCB @ (0, 1.95) | (4)
- Notes
- (1) This pin is connected to a bus bar for power distribution, but the CFT does not (yet) require it.
- It's likely to be connected to another voltage level like +3.3V for easier interfacing. Reserved for now.
- (2) Pins *TPA and *TPC are not bussed. They are locally connected to each card's corresponding
- test pins (A17 & C17) to serve as test points.
- (3) Reserved for future expansion
- (4) Cheaper, 64-pin A+C row DIN41662 Type C plugs may be used for most expansion cards.
- (5) !IRQ! is provided for systems which lack an interrupt controller (!IRQ0-7!)
- @(0.15, 3.675) | @(5.775, 3.675)
- U
- @(0.15, 0.25) | @(5.775, 0.25)

## Sheet 3 of 3
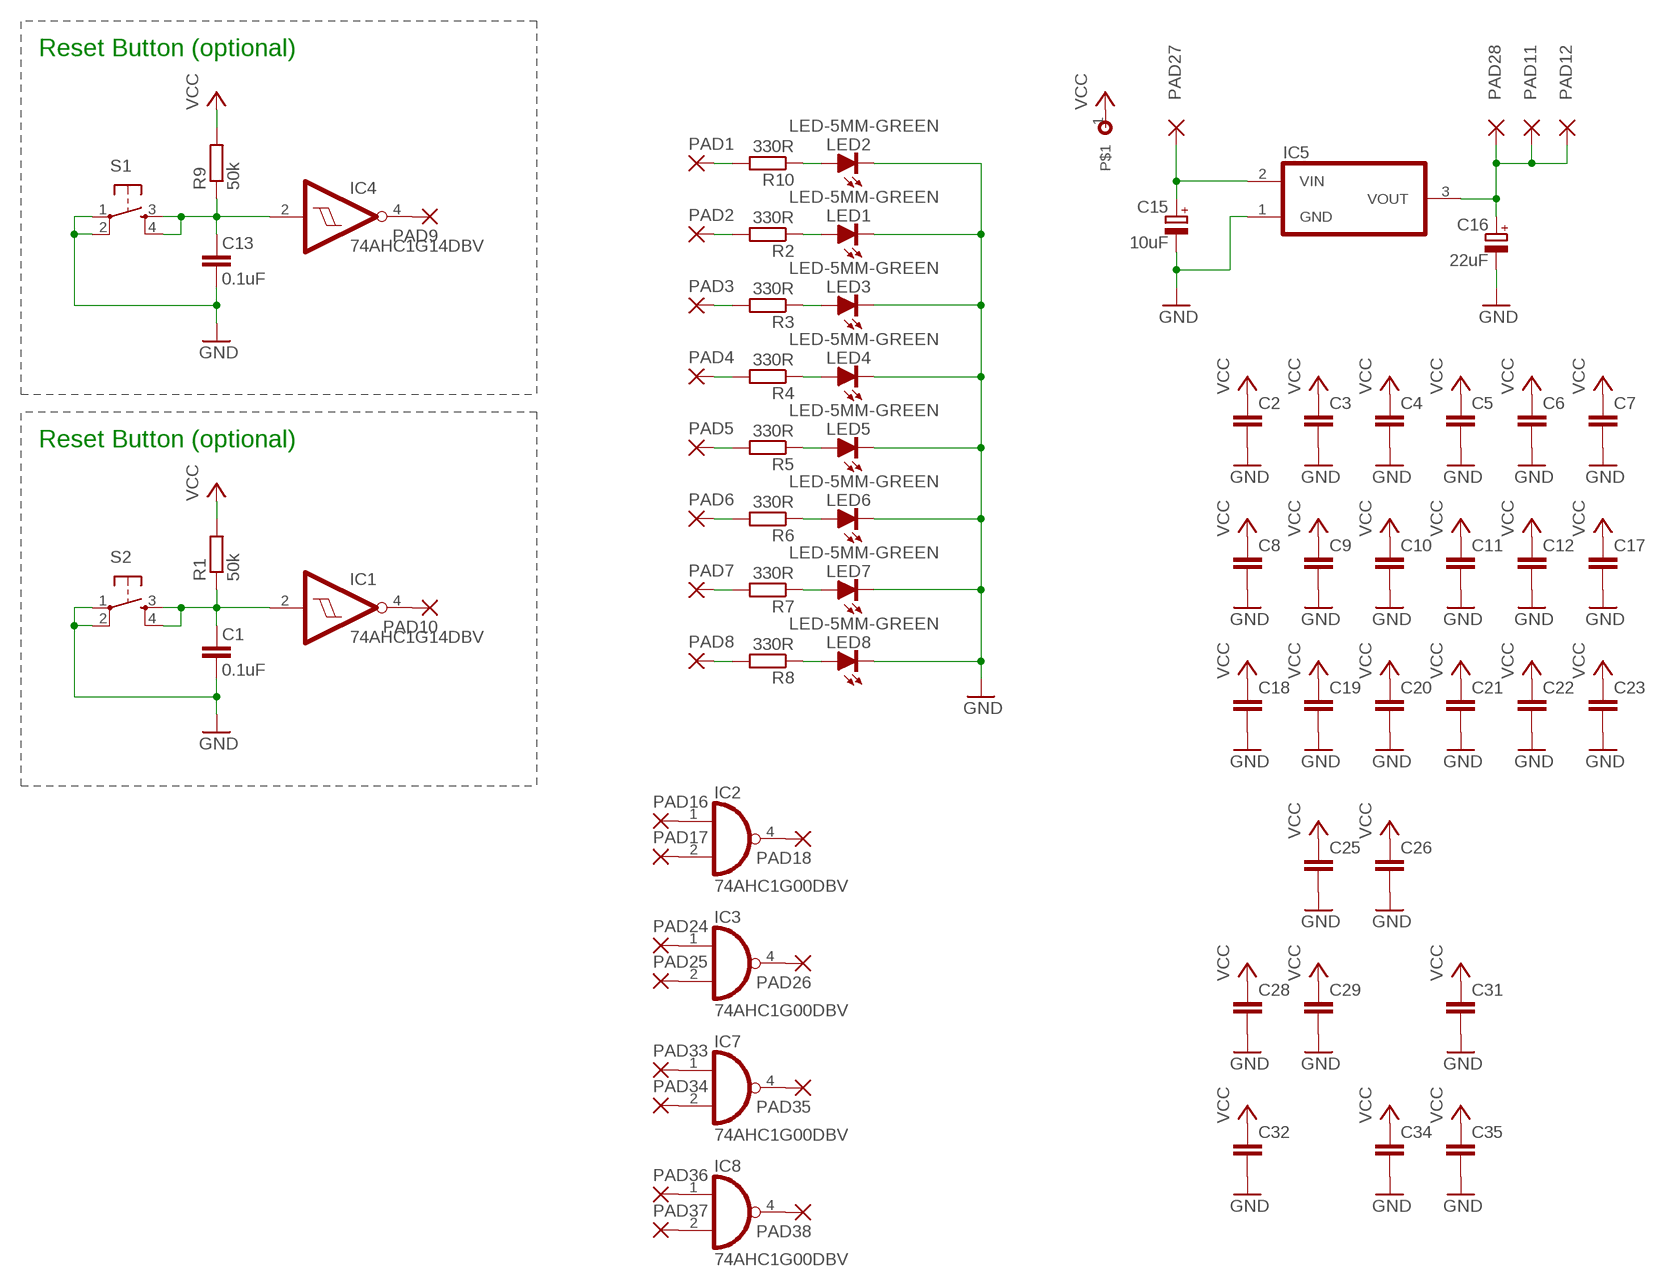
[diagram p4: schematic, sheet 3]

### Parts
C1  0.1uF  C-EUC0805K  [C0805K]
C2  C-EUC0805K  [C0805K]
C3  C-EUC0805K  [C0805K]
C4  C-EUC0805K  [C0805K]
C5  C-EUC0805K  [C0805K]
C6  C-EUC0805K  [C0805K]
C7  C-EUC0805K  [C0805K]
C8  C-EUC0805K  [C0805K]
C9  C-EUC0805K  [C0805K]
C10  C-EUC0805K  [C0805K]
C11  C-EUC0805K  [C0805K]
C12  C-EUC0805K  [C0805K]
C13  0.1uF  C-EUC0805K  [C0805K]
C15  10uF  CPOL-EUE2-5  [E2-5]
C16  22uF  CPOL-EUE2-5  [E2-5]
C17  C-EUC0805K  [C0805K]
C18  C-EUC0805K  [C0805K]
C19  C-EUC0805K  [C0805K]
C20  C-EUC0805K  [C0805K]
C21  C-EUC0805K  [C0805K]
C22  C-EUC0805K  [C0805K]
C23  C-EUC0805K  [C0805K]
C25  C-EUC0805K  [C0805K]
C26  C-EUC0805K  [C0805K]
C28  C-EUC0805K  [C0805K]
C29  C-EUC0805K  [C0805K]
C31  C-EUC0805K  [C0805K]
C32  C-EUC0805K  [C0805K]
C34  C-EUC0805K  [C0805K]
C35  C-EUC0805K  [C0805K]
IC1  74AHC1G14DBV  [SOT23-5]
IC2  74AHC1G00DBV  [SOT23-5]
IC3  74AHC1G00DBV  [SOT23-5]
IC4  74AHC1G14DBV  [SOT23-5]
IC5  AP1117D18  [TO252]
IC7  74AHC1G00DBV  [SOT23-5]
IC8  74AHC1G00DBV  [SOT23-5]
LED1  LED-5MM-GREEN  LEDCHIPLED_0805  [CHIPLED_0805]
LED2  LED-5MM-GREEN  LEDCHIPLED_0805  [CHIPLED_0805]
LED3  LED-5MM-GREEN  LEDCHIPLED_0805  [CHIPLED_0805]
LED4  LED-5MM-GREEN  LEDCHIPLED_0805  [CHIPLED_0805]
LED5  LED-5MM-GREEN  LEDCHIPLED_0805  [CHIPLED_0805]
LED6  LED-5MM-GREEN  LEDCHIPLED_0805  [CHIPLED_0805]
LED7  LED-5MM-GREEN  LEDCHIPLED_0805  [CHIPLED_0805]
LED8  LED-5MM-GREEN  LEDCHIPLED_0805  [CHIPLED_0805]
P196  PROTOTYPING-PAD-1X1  [PAD-1X1]
PAD1  1,6/0,9  [1,6/0,9]
PAD2  1,6/0,9  [1,6/0,9]
PAD3  1,6/0,9  [1,6/0,9]
PAD4  1,6/0,9  [1,6/0,9]
PAD5  1,6/0,9  [1,6/0,9]
PAD6  1,6/0,9  [1,6/0,9]
PAD7  1,6/0,9  [1,6/0,9]
PAD8  1,6/0,9  [1,6/0,9]
PAD9  1,6/0,9  [1,6/0,9]
PAD10  1,6/0,9  [1,6/0,9]
PAD11  1,6/0,9  [1,6/0,9]
PAD12  1,6/0,9  [1,6/0,9]
PAD16  1,6/0,9  [1,6/0,9]
PAD17  1,6/0,9  [1,6/0,9]
PAD18  1,6/0,9  [1,6/0,9]
PAD24  1,6/0,9  [1,6/0,9]
PAD25  1,6/0,9  [1,6/0,9]
PAD26  1,6/0,9  [1,6/0,9]
PAD27  1,6/0,9  [1,6/0,9]
PAD28  1,6/0,9  [1,6/0,9]
PAD33  1,6/0,9  [1,6/0,9]
PAD34  1,6/0,9  [1,6/0,9]
PAD35  1,6/0,9  [1,6/0,9]
PAD36  1,6/0,9  [1,6/0,9]
PAD37  1,6/0,9  [1,6/0,9]
PAD38  1,6/0,9  [1,6/0,9]
R1  50k  R-EU_R0805  [R0805]
R2  330R  R-EU_R0805  [R0805]
R3  330R  R-EU_R0805  [R0805]
R4  330R  R-EU_R0805  [R0805]
R5  330R  R-EU_R0805  [R0805]
R6  330R  R-EU_R0805  [R0805]
R7  330R  R-EU_R0805  [R0805]
R8  330R  R-EU_R0805  [R0805]
R9  50k  R-EU_R0805  [R0805]
R10  330R  R-EU_R0805  [R0805]
S1  TAC_SWITCHPTH  [TACTILE-PTH]
S2  TAC_SWITCHPTH  [TACTILE-PTH]

### Nets
GND [Power rails]: C1.1 C2.2 C3.2 C4.2 C5.2 C6.2 C7.2 C8.2 C9.2 C10.2 C11.2 C12.2 C13.1 C15.- C16.- C17.2 C18.2 C19.2 C20.2 C21.2 C22.2 C23.2 C25.2 C26.2 C28.2 C29.2 C31.2 C32.2 C34.2 C35.2 IC5.1(GND) LED1.C LED2.C LED3.C LED4.C LED5.C LED6.C LED7.C LED8.C S1.1 S1.2 S2.1 S2.2 ; also sheet 2
N$1: C1.2 IC1.2(I) R1.1 S2.3 S2.4
N$2: PAD1.1(P) R10.2
N$3: IC4.4(O) PAD9.1(P)
N$4: IC1.4(O) PAD10.1(P)
N$16: IC2.1(I0) PAD16.1(P)
N$17: IC2.2(I1) PAD17.1(P)
N$18: IC2.4(O) PAD18.1(P)
N$19: IC3.1(I0) PAD24.1(P)
N$20: IC3.2(I1) PAD25.1(P)
N$21: IC3.4(O) PAD26.1(P)
N$22 [Power rails]: C15.+ IC5.2(VIN) PAD27.1(P)
N$23: C16.+ IC5.3(VOUT) PAD11.1(P) PAD12.1(P) PAD28.1(P)
N$28: IC7.1(I0) PAD33.1(P)
N$29: IC7.2(I1) PAD34.1(P)
N$30: IC7.4(O) PAD35.1(P)
N$31: IC8.1(I0) PAD36.1(P)
N$32: IC8.2(I1) PAD37.1(P)
N$33: C13.2 IC4.2(I) R9.1 S1.3 S1.4
N$34: IC8.4(O) PAD38.1(P)
POWERLED: LED2.A R10.1
POWERLED1: LED1.A R2.1
POWERLED2: LED3.A R3.1
POWERLED3: LED4.A R4.1
POWERLED4: LED5.A R5.1
POWERLED5: LED6.A R6.1
POWERLED6: LED7.A R7.1
POWERLED7: LED8.A R8.1
POWEROK1: PAD2.1(P) R2.2
POWEROK2: PAD3.1(P) R3.2
POWEROK3: PAD4.1(P) R4.2
POWEROK4: PAD5.1(P) R5.2
POWEROK5: PAD6.1(P) R6.2
POWEROK6: PAD7.1(P) R7.2
POWEROK7: PAD8.1(P) R8.2
VCC [Power rails]: C2.1 C3.1 C4.1 C5.1 C6.1 C7.1 C8.1 C9.1 C10.1 C11.1 C12.1 C17.1 C18.1 C19.1 C20.1 C21.1 C22.1 C23.1 C25.1 C26.1 C28.1 C29.1 C31.1 C32.1 C34.1 C35.1 P196.1 R1.2 R9.2 ; also sheet 2

### Notes on the sheet
- Reset Button (optional)
- Reset Button (optional)

## Power pins joined to a net without a drawn wire
GND: IC1.3(GND) IC2.3(GND) IC3.3(GND) IC4.3(GND) IC7.3(GND) IC8.3(GND)
VCC: IC1.5(VCC) IC2.5(VCC) IC3.5(VCC) IC4.5(VCC) IC7.5(VCC) IC8.5(VCC)

## Library data of the parts
$4_37_$1 = alexios:SIGNATURE: Soup signature
$4_39_$1 = SparkFun:OSHW-LOGO: Open Source Hardware Logo This logo indicates the piece of hardware it is found on incorporates a OSHW license and/or adheres to the definition of open source hardware found here: http://freedomdefined.org/OSHW
C1-C13 C17-C23 C25 C26 C28 C29 C31 C32 C34 C35 = rcl:C-EU: CAPACITOR, European symbol
C14-C16 C57 = rcl:CPOL-EU: POLARIZED CAPACITOR, European symbol
EXP1 = alexios-19inch:VG96-3: PCB EUROCARD, 96-pin type C/ABC, 2.54 mm
IC1 IC4 = alexios:74*1G14: Single Schmitt-Trigger Inverter Gate
IC2 IC3 IC7 IC8 = alexios:74*1G00: 2-input NAND gate
IC5 = alexios:AP1117: 1A LOW DROPOUT (LDO) POSITIVE FIXED-MODE REGULATOR http://www.farnell.com/datasheets/608751.pdf
LED1-LED8 = alexios:LED: LED OSRAM: - CHIPLED LG R971, LG N971, LY N971, LG Q971, LY Q971, LO R971, LY R971 LH N974, LH R974 LS Q976, LO Q976, LY Q976 LO Q996 - Hyper CHIPLED LW Q18S LB Q993, LB Q99A, LB R99A - SideLED LS A670, LO A670, LY A670, LG A670, LP A670 LB A673, LV A673, LT A673, LW A673 LH A674 LY A675 LS A676, LA A676, LO A676, LY A676, LW A676 LS A679, LY A679, LG A679 - Hyper Micro SIDELED® LS Y876, LA Y876, LO Y876, LY Y876 LT Y87S - SmartLED LW L88C, LW L88S LB L89C, LB L89S, LG L890 LS L89K, LO L89K, LY L89K LS L896, LA L896, LO L896, LY L896 - TOPLED LS T670, LO T670, LY T670, LG T670, LP T670 LSG T670, LSP T670, LSY T670, LOP T670, LYG T670 LG T671, LOG T671, LSG T671 LB T673, LV T673, LT T673, LW T673 LH T674 LS T676, LA T676, LO T676, LY T676, LB T676, LH T676, LSB T676, LW T676 LB T67C, LV T67C, LT T67C, LS T67K, LO T67K, LY T67K, LW E67C LS E67B, LA E67B, LO E67B, LY E67B, LB E67C, LV E67C, LT E67C LW T67C LS T679, LY T679, LG T679 LS T770, LO T770, LY T770, LG T770, LP T770 LB T773, LV T773, LT T773, LW T773 LH T774 LS E675, LA E675, LY E675, LS T675 LS T776, LA T776, LO T776, LY T776, LB T776 LHGB T686 LT T68C, LB T68C - Hyper Mini TOPLED® LB M676 - Mini TOPLED Santana® LG M470 LS M47K, LO M47K, LY M47K Source: http://www.osram.convergy.de LUXEON: - LUMILED® LXK2-PW12-R00, LXK2-PW12-S00, LXK2-PW14-U00, LXK2-PW14-V00 LXK2-PM12-R00, LXK2-PM12-S00, LXK2-PM14-U00 LXK2-PE12-Q00, LXK2-PE12-R00, LXK2-PE12-S00, LXK2-PE14-T00, LXK2-PE14-U00 LXK2-PB12-K00, LXK2-PB12-L00, LXK2-PB12-M00, LXK2-PB14-N00, LXK2-PB14-P00, LXK2-PB14-Q00 LXK2-PR12-L00, LXK2-PR12-M00, LXK2-PR14-Q00, LXK2-PR14-R00 LXK2-PD12-Q00, LXK2-PD12-R00, LXK2-PD12-S00 LXK2-PH12-R00, LXK2-PH12-S00 LXK2-PL12-P00, LXK2-PL12-Q00, LXK2-PL12-R00 Source: www.luxeon.com KINGBRIGHT: KA-3528ASYC Source: www.kingbright.com
P1-P3 = con-3m:2540-: 3M (TM) Pak 100 4-Wall Header Source: 3M; OC_FARNELL: 9838414; OC_NEWARK: unknown
P4 P5 P13-P16 P24 P25 P43-P62 P73-P76 P78-P92 P103-P122 P133-P152 P197-P200 P205 P206 P211 P212 P264 P268-P271 P275-P281 = alexios:PROTOTYPING-PAD-1X8
P6 P17 P26 P33-P42 P63-P72 P77 P93-P102 P123-P132 P153-P193 P201-P204 P213-P216 P221 P222 P229-P233 P237 P238 P253 = alexios:PROTOTYPING-PAD-1X4
P7-P12 P18-P23 P27-P32 P194-P196 P209 P210 P217-P220 P223-P228 P239-P241 P245-P249 P254-P263 P265-P267 P272-P274 P282-P291 = alexios:PROTOTYPING-PAD-1X1
P207 P208 P234-P236 P242-P244 P250-P252 = alexios:PROTOTYPING-PAD-2X8
PAD1-PAD12 PAD16-PAD18 PAD24-PAD28 PAD33-PAD38 = wirepad:1,6/0,9: THROUGH-HOLE PAD
R1-R10 = resistor:R-EU_: RESISTOR, European symbol
S1 S2 = SparkFun:TAC_SWITCH: Momentary Switch Button commonly used for reset or general input. Spark Fun Electronics SKU : COM-00097
U1-U4 = alexios:HOLE: Hole for a standoff or mount. Hole diameter: 3.3mm. External Diameter: 6mm. Suitable for M3 standoffs.
U$1-U$6 U$11-U$21 U$23 U$25 U$27 U$29 U$31 U$33 U$35-U$46 = alexios:PROTOTYPING-PAD-1X2

## Net classes
0 default: width 0.254 mm, clearance 0.152 mm
1 low power: width 0.254 mm, clearance 0.152 mm
2 Power rails: width 0.61 mm, clearance 0.152 mm